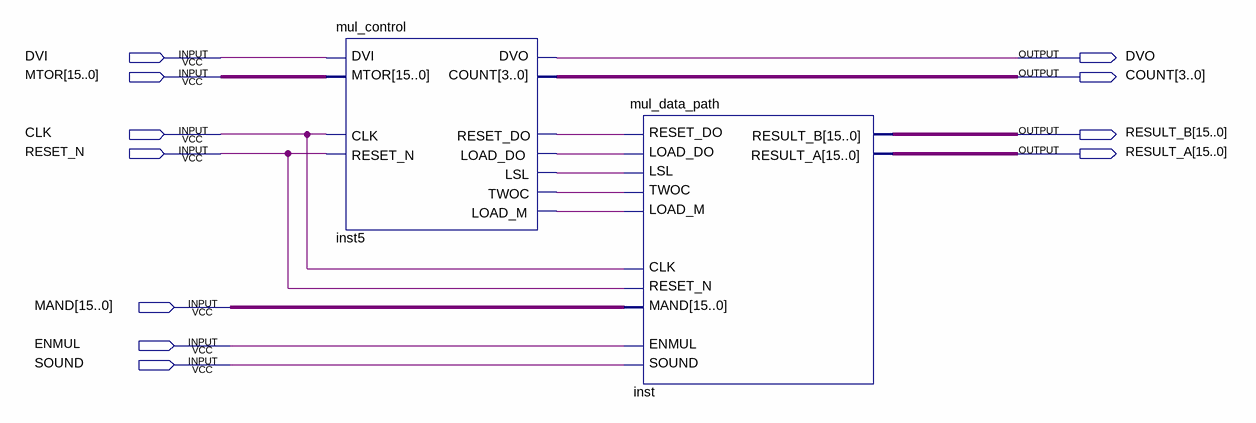
[diagram p0: schematic sheet]
// Quartus schematic mul.bdf as structural Verilog: 2 symbols, 11 pins
module mul (
  input  DVI,
  input  [15:0] MTOR,
  input  CLK,
  input  RESET_N,
  input  [15:0] MAND,
  input  ENMUL,
  input  SOUND,
  output DVO,
  output [3:0] COUNT,
  output [15:0] RESULT_B,
  output [15:0] RESULT_A
);

  wire inst5_load_do, inst5_load_m, inst5_lsl, inst5_reset_do, inst5_twoc;

  mul_control inst5 (
    .DVI(DVI), .MTOR(MTOR), .CLK(CLK), .RESET_N(RESET_N), .DVO(DVO), .COUNT(COUNT),
    .RESET_DO(inst5_reset_do), .LOAD_DO(inst5_load_do), .LSL(inst5_lsl), .TWOC(inst5_twoc),
    .LOAD_M(inst5_load_m));
  mul_data_path inst (
    .TWOC(inst5_twoc), .MAND(MAND), .LSL(inst5_lsl), .LOAD_M(inst5_load_m), .CLK(CLK),
    .LOAD_DO(inst5_load_do), .RESET_N(RESET_N), .RESET_DO(inst5_reset_do), .ENMUL(ENMUL), .SOUND(SOUND),
    .RESULT_B(RESULT_B), .RESULT_A(RESULT_A));
endmodule
